# EAGLE design Uzebox Game Console F2 (EAGLE 5.11)
DPN: MCP1700-3302E/TO-ND; PN: 641-1310-1-ND
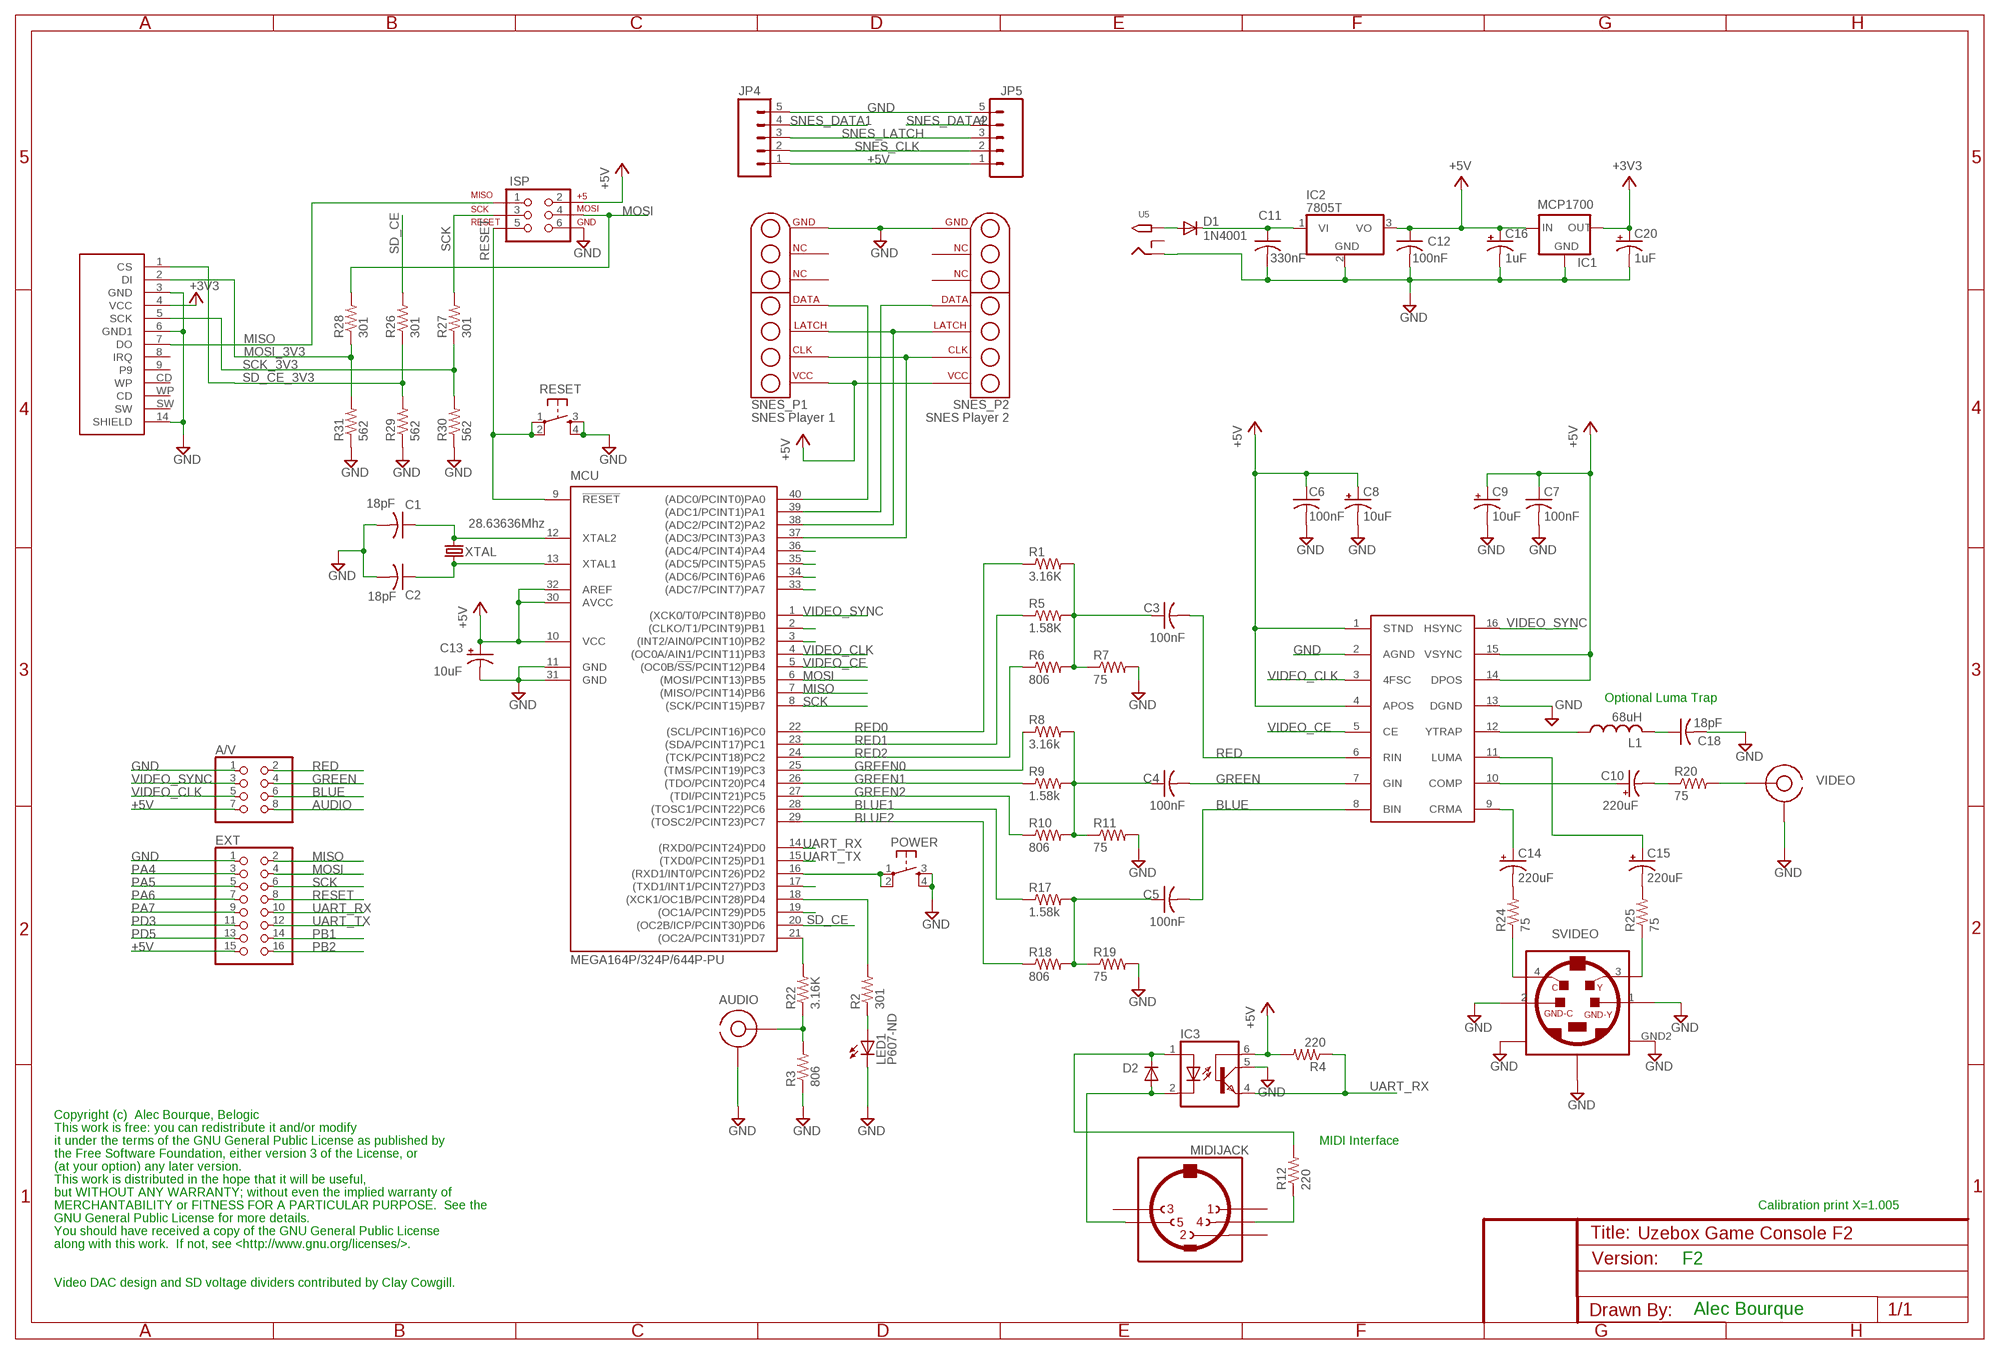
[diagram p0: schematic, sheet 1]

## Parts
A/V  PINHD-2X4  [2X04]
AD725  AD725  [SO16W]
AUDIO  RCA  [RCA]
C1  18pF  C-US025-025X050  [C025-025X050]
C2  18pF  C-US025-025X050  [C025-025X050]
C3  100nF  C-US025-025X050  [C025-025X050]
C4  100nF  C-US025-025X050  [C025-025X050]
C5  100nF  C-US025-025X050  [C025-025X050]
C6  100nF  C-US025-025X050  [C025-025X050]
C7  100nF  C-US025-025X050  [C025-025X050]
C8  10uF  CPOL-USE2.5-6  [E2,5-6]
C9  10uF  CPOL-USE2.5-6  [E2,5-6]
C10  220uF  CPOL-USE2.5-6  [E2,5-6]
C11  330nF  C-US025-025X050  [C025-025X050]
C12  100nF  C-US025-025X050  [C025-025X050]
C13  10uF  CPOL-USE2.5-6  [E2,5-6]
C14  220uF  CPOL-USE2.5-6  [E2,5-6]
C15  220uF  CPOL-USE2.5-6  [E2,5-6]
C16  1uF  CPOL-USE2.5-6  [E2,5-6]
C18  18pF  C-US025-025X050  [C025-025X050]
C20  1uF  CPOL-USE2.5-6  [E2,5-6]
D1  1N4001  1N4004  [DO41-10]
D2  1N4148DO35-7  [DO35-7]
EXT  PINHD-2X8  [2X08]
IC1  MCP1700  MCP1700INLINE  [TO92-INLINE]
IC2  7805T  [TO220H]
IC3  PC110  [DIL06]
ISP  AVR_SPI_PRG_6PTH  [2X3]
JP4  M05PTH  [1X05]
JP5  M05PTH  [1X05]
L1  68uH  L-US6000-XXX-RC  [6000-XXXX-RC]
LED1  P607-ND  LED3MM  [LED3MM]
MCU  MEGA164P/324P/644P-PU  [DIL40]
POWER  USER  TAC_SWITCHPTH  [TACTILE-PTH]
R1  3.16K  R-US_0207/10  [0207/10]
R2  301  R-US_0207/10  [0207/10]
R3  806  R-US_0207/10  [0207/10]
R4  220  R-US_0207/10  [0207/10]
R5  1.58K  R-US_0207/10  [0207/10]
R6  806  R-US_0207/10  [0207/10]
R7  75  R-US_0207/10  [0207/10]
R8  3.16k  R-US_0207/10  [0207/10]
R9  1.58k  R-US_0207/10  [0207/10]
R10  806  R-US_0207/10  [0207/10]
R11  75  R-US_0207/10  [0207/10]
R12  220  R-US_0207/10  [0207/10]
R17  1.58k  R-US_0207/10  [0207/10]
R18  806  R-US_0207/10  [0207/10]
R19  75  R-US_0207/10  [0207/10]
R20  75  R-US_0207/10  [0207/10]
R22  3.16K  R-US_0207/10  [0207/10]
R24  75  R-US_0207/10  [0207/10]
R25  75  R-US_0207/10  [0207/10]
R26  301  R-US_0207/10  [0207/10]
R27  301  R-US_0207/10  [0207/10]
R28  301  R-US_0207/10  [0207/10]
R29  562  R-US_0207/10  [0207/10]
R30  562  R-US_0207/10  [0207/10]
R31  562  R-US_0207/10  [0207/10]
RESET  RESET  TAC_SWITCHPTH  [TACTILE-PTH]
SD/MMC  SD_CARD_SOCKETSD  [SD-MMC_SOCKET-PP]
SNES_P1  SNES Player 1  SNES_CONNECTOR  [SNES_CONNECTOR]
SNES_P2  SNES Player 2  SNES_CONNECTOR  [SNES_CONNECTOR]
SVIDEO  S-VIDEO OUT  MINIDIN  [MINIDIN4]
U5  DC IN  2.1MMJACKTHM  [PJ-102A]
U$5  MIDIJACK  [CP-2350]
VIDEO  RCA  [RCA]
XTAL  28.63636Mhz  CRYSTALHC49S  [HC49/S]

## Nets
+3V3: C20.+ IC1.3(OUT) SD/MMC.4(VCC)
+5V: A/V.7 AD725.1(STND) AD725.4(APOS) AD725.14(DPOS) AD725.15(VSYNC) C6.1 C7.1 C8.+ C9.+ C12.1 C13.+ C16.+ EXT.15 IC1.2(IN) IC2.3(VO) IC3.6(BAS) ISP.2 JP4.1 JP5.1 MCU.10(VCC) MCU.30(AVCC) MCU.32(AREF) R4.2 SNES_P1.P$8(VCC) SNES_P2.P$8(VCC)
AUDIO: A/V.8 AUDIO.SIG R3.2 R22.1
BLUE: A/V.6 AD725.8(BIN) C5.2
BLUE1: MCU.28((TOSC1/PCINT22)PC6) R17.1
BLUE2: MCU.29((TOSC2/PCINT23)PC7) R18.1
GND: A/V.1 AD725.2(AGND) AD725.13(DGND) AUDIO.GND C1.2 C2.2 C6.2 C7.2 C8.- C9.- C11.2 C12.2 C13.- C16.- C18.2 C20.- EXT.1 IC1.1(GND) IC2.2(GND) IC3.5(COL) ISP.6 JP4.5 JP5.5 LED1.K(C) MCU.11(GND) MCU.31(GND) POWER.3 POWER.4 R3.1 R7.2 R11.2 R19.2 R29.1 R30.1 R31.1 RESET.3 RESET.4 SD/MMC.3(GND) SD/MMC.6(GND1) SD/MMC.14(SHIELD) SNES_P1.P$14(GND) SNES_P2.P$14(GND) SVIDEO.1(GND-Y) SVIDEO.2(GND-C) SVIDEO.GND1 SVIDEO.GND2 SVIDEO.GND3 U5.RING VIDEO.GND
GREEN: A/V.4 AD725.7(GIN) C4.2
GREEN0: MCU.25((TMS/PCINT19)PC3) R8.1
GREEN1: MCU.26((TDO/PCINT20)PC4) R9.1
GREEN2: MCU.27((TDI/PCINT21)PC5) R10.1
MISO: EXT.2 ISP.1 MCU.7((MISO/PCINT14)PB6) SD/MMC.7(DO)
MOSI: EXT.4 ISP.4 MCU.6((MOSI/PCINT13)PB5) R28.2
MOSI_3V3: R28.1 R31.2 SD/MMC.2(DI)
N$1: AD725.12(YTRAP) L1.1
N$2: C18.1 L1.2
N$3: C5.1 R17.2 R18.2 R19.1
N$4: C4.1 R8.2 R9.2 R10.2 R11.1
N$5: C3.1 R1.2 R5.2 R6.2 R7.1
N$6: C10.- R20.1
N$7: AD725.10(COMP) C10.+
N$8: R20.2 VIDEO.SIG
N$9: C1.1 MCU.12(XTAL2) XTAL.2
N$10: D1.A U5.TIP
N$11: C14.- R24.2
N$12: C2.1 MCU.13(XTAL1) XTAL.1
N$13: MCU.21((OC2A/PCINT31)PD7) R22.2
N$14: D2.A IC3.2(C) U$5.5
N$16: D2.C IC3.1(A) R12.2
N$17: R12.1 U$5.4
N$20: C11.1 D1.C IC2.1(VI)
N$23: MCU.18((XCK1/OC1B/PCINT28)PD4) R2.2
N$25: LED1.A R2.1
N$26: C15.- R25.2
N$28: AD725.11(LUMA) C15.+
N$29: AD725.9(CRMA) C14.+
N$30: R24.1 SVIDEO.4(C)
N$31: R25.1 SVIDEO.3(Y)
PA4: EXT.3 MCU.36((ADC4/PCINT4)PA4)
PA5: EXT.5 MCU.35((ADC5/PCINT5)PA5)
PA6: EXT.7 MCU.34((ADC6/PCINT6)PA6)
PA7: EXT.9 MCU.33((ADC7/PCINT7)PA7)
PB1: EXT.14 MCU.2((CLKO/T1/PCINT9)PB1)
PB2: EXT.16 MCU.3((INT2/AIN0/PCINT10)PB2)
PD3: EXT.11 MCU.17((TXD1/INT1/PCINT27)PD3)
PD5: EXT.13 MCU.19((OC1A/PCINT29)PD5)
POWER_SW: MCU.16((RXD1/INT0/PCINT26)PD2) POWER.1 POWER.2
RED: A/V.2 AD725.6(RIN) C3.2
RED0: MCU.22((SCL/PCINT16)PC0) R1.1
RED1: MCU.23((SDA/PCINT17)PC1) R5.1
RED2: MCU.24((TCK/PCINT18)PC2) R6.1
RESET: EXT.8 ISP.5 MCU.9(!RESET) RESET.1 RESET.2
SCK: EXT.6 ISP.3 MCU.8((SCK/PCINT15)PB7) R27.2
SCK_3V3: R27.1 R30.2 SD/MMC.5(SCK)
SD_CE: MCU.20((OC2B/ICP/PCINT30)PD6) R26.2
SD_CE_3V3: R26.1 R29.2 SD/MMC.1(CS)
SNES_CLK: JP4.2 JP5.2 MCU.37((ADC3/PCINT3)PA3) SNES_P1.P$9(CLK) SNES_P2.P$9(CLK)
SNES_DATA1: JP4.4 MCU.40((ADC0/PCINT0)PA0) SNES_P1.P$11(DATA)
SNES_DATA2: JP5.4 MCU.39((ADC1/PCINT1)PA1) SNES_P2.P$11(DATA)
SNES_LATCH: JP4.3 JP5.3 MCU.38((ADC2/PCINT2)PA2) SNES_P1.P$10(LATCH) SNES_P2.P$10(LATCH)
UART_RX: EXT.10 IC3.4(EMI) MCU.14((RXD0/PCINT24)PD0) R4.1
UART_TX: EXT.12 MCU.15((TXD0/PCINT25)PD1)
VIDEO_CE: AD725.5(CE) MCU.5((OC0B/!SS!/PCINT12)PB4)
VIDEO_CLK: A/V.5 AD725.3(4FSC) MCU.4((OC0A/AIN1/PCINT11)PB3)
VIDEO_SYNC: A/V.3 AD725.16(HSYNC) MCU.1((XCK0/T0/PCINT8)PB0)
Unconnected: SD/MMC.8(IRQ) SD/MMC.9 SD/MMC.CD(WP) SD/MMC.SW SD/MMC.WP(CD) SNES_P1.P$12(NC1) SNES_P1.P$13(NC2) SNES_P2.P$12(NC1) SNES_P2.P$13(NC2) U5.RING_SW U$5.1 U$5.2 U$5.3 U$5.PE1(MT) U$5.PE2(MT) U$5.PE(MT) U$5.PE@(MT)

## Notes on the sheet
- Optional Luma Trap
- Copyright (c)  Alec Bourque, Belogic
- This work is free: you can redistribute it and/or modify
- it under the terms of the GNU General Public License as published by | MIDI Interface
- the Free Software Foundation, either version 3 of the License, or
- (at your option) any later version.
- This work is distributed in the hope that it will be useful,
- but WITHOUT ANY WARRANTY; without even the implied warranty of
- MERCHANTABILITY or FITNESS FOR A PARTICULAR PURPOSE.  See the | Calibration print X=1.005
- GNU General Public License for more details.
- You should have received a copy of the GNU General Public License
- along with this work.  If not, see <http://www.gnu.org/licenses/>.
- F2
- Video DAC design and SD voltage dividers contributed by Clay Cowgill.
- Alec Bourque

## Library data of the parts
A/V = pinhead:PINHD-2X4: PIN HEADER
AD725 = ad725:AD725
AUDIO VIDEO = rca:RCA: RCA jack
C1 C2 C6 C7 C11 C12 C18 = resistor:C-US: CAPACITOR, American symbol
C3-C5 = rcl:C-US: CAPACITOR, American symbol
C8-C10 C13-C16 C20 = rcl:CPOL-US: POLARIZED CAPACITOR, American symbol
D1 = adafruit:1N4004: DIODE General purpose 1N400x type rectifier (With bigger pads) http://www.ladyada.net/library/pcb/eaglelibrary.html
D2 = diode:1N4148: DIODE high speed (Philips)
EXT = pinhead:PINHD-2X8: PIN HEADER
IC1 = adafruit:MCP1700: VOLTAGE REGULATOR
IC2 = adafruit:78*: Positive VOLTAGE REGULATOR Added bigger pads to the TO-92 package
IC3 = optocoupler:PC110: SHARP OPTO COUPLER; OC_FARNELL: unknown; OC_NEWARK: unknown
ISP = SparkFun:AVR_SPI_PRG_6: AVR ISP 6 Pin This is the reduced ISP connector for AVR programming. Common on Arduino. This footprint will take up less PCB space and can be used with a 10-pin to 6-pin adapter such as SKU: BOB-08508
JP4 JP5 = SparkFun:M05: Header 5 Standard 5-pin 0.1" header. Use with straight break away headers (SKU : PRT-00116), right angle break away headers (PRT-00553), swiss pins (PRT-00743), machine pins (PRT-00117), and female headers (PRT-00115). Molex polarized connector foot print use with SKU : PRT-08230 with associated crimp pins and housings.
L1 = rcl:L-US: INDUCTOR, American symbol
LED1 = adafruit:LED: LED OSRAM: - CHIPLED LG R971, LG N971, LY N971, LG Q971, LY Q971, LO R971, LY R971 LH N974, LH R974 LS Q976, LO Q976, LY Q976 LO Q996 - Hyper CHIPLED LW Q18S LB Q993, LB Q99A, LB R99A - SideLED LS A670, LO A670, LY A670, LG A670, LP A670 LB A673, LV A673, LT A673, LW A673 LH A674 LY A675 LS A676, LA A676, LO A676, LY A676, LW A676 LS A679, LY A679, LG A679 - Hyper Micro SIDELED® LS Y876, LA Y876, LO Y876, LY Y876 LT Y87S - SmartLED LW L88C, LW L88S LB L89C, LB L89S, LG L890 LS L89K, LO L89K, LY L89K LS L896, LA L896, LO L896, LY L896 - TOPLED LS T670, LO T670, LY T670, LG T670, LP T670 LSG T670, LSP T670, LSY T670, LOP T670, LYG T670 LG T671, LOG T671, LSG T671 LB T673, LV T673, LT T673, LW T673 LH T674 LS T676, LA T676, LO T676, LY T676, LB T676, LH T676, LSB T676, LW T676 LB T67C, LV T67C, LT T67C, LS T67K, LO T67K, LY T67K, LW E67C LS E67B, LA E67B, LO E67B, LY E67B, LB E67C, LV E67C, LT E67C LW T67C LS T679, LY T679, LG T679 LS T770, LO T770, LY T770, LG T770, LP T770 LB T773, LV T773, LT T773, LW T773 LH T774 LS E675, LA E675, LY E675, LS T675 LS T776, LA T776, LO T776, LY T776, LB T776 LHGB T686 LT T68C, LB T68C - Hyper Mini TOPLED® LB M676 - Mini TOPLED Santana® LG M470 LS M47K, LO M47K, LY M47K Source: http://www.osram.convergy.de/
MCU = avr-5:MEGA164P/324P/644P-PU
POWER RESET = SparkFun:TAC_SWITCH: Momentary Switch Button commonly used for reset or general input. Spark Fun Electronics SKU : COM-00097
R1-R12 R17-R20 R22 R24-R31 = resistor:R-US_: RESISTOR, American symbol
SD/MMC = SparkFun:SD_CARD_SOCKET: SD/MMC Socket Media socket for SD and MMC cards. Push-push type. Schematic element and footprint production proven. Spark Fun Electronics SKU : PRT-00136
SNES_P1 SNES_P2 = snes:SNES_CONNECTOR: Generic SNES connector
SVIDEO = mini-din4:MINIDIN: mini-din 4 connector
U5 = adafruit:2.1MMJACK: 2.1mm x 5.5mm THM DC jack with internal switch. Digikey part #PJ-102A, 4UCON part #05537 2.1mm x 5.5mm SMT DC jack with internal switch. Digikey part #PJ-002A-SMT, 4UCON part #03267 By microbuilder.eu & adafruit.com
U$5 = adafruit:MIDIJACK: DIN 5 jack also known as MIDI jack A modification of conn-hirshman:MAB5SH with two options for the grounding 'teeth'
XTAL = crystal:CRYSTAL: CRYSTAL; OC_FARNELL: 1667008; OC_NEWARK: unknown

## Board
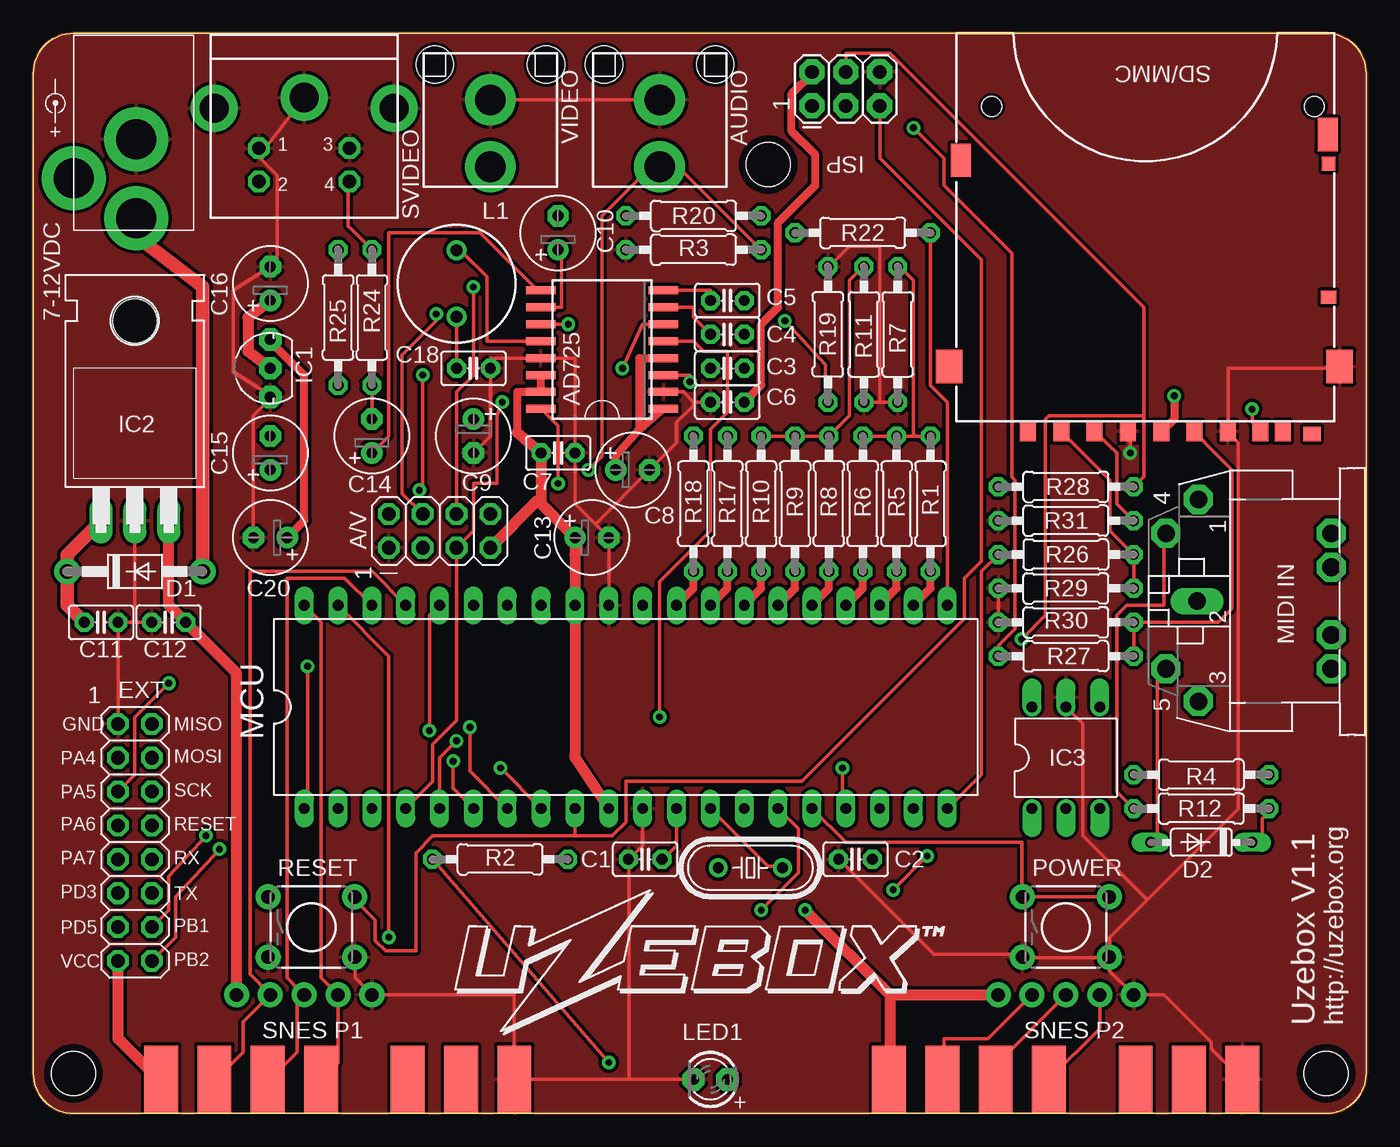
[diagram p1: board, top side]
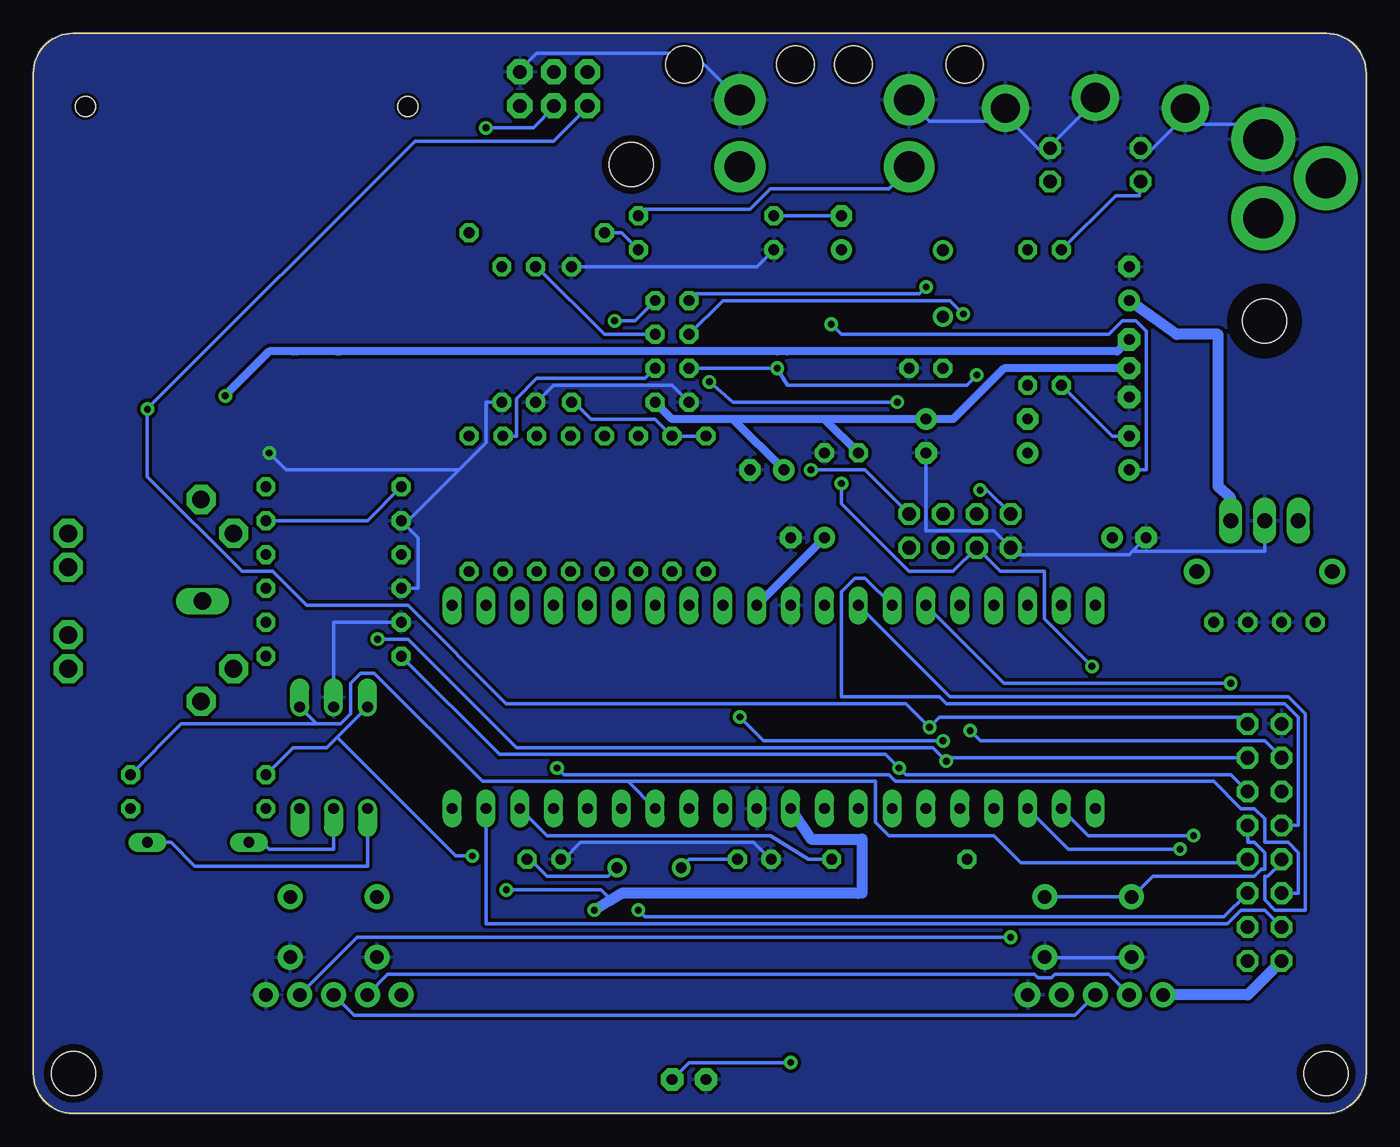
[diagram p2: board, bottom side, seen from below]

Size 100 x 81 mm. Coordinates in mm from the lower left corner, seen from the top.
Outline: 3,0 arc-90 0,3 0,78 arc-90 3,81 97,81 arc-90 100,78 100,3 arc-90 97,0 3,0
Copper layers (1*16): Top 0.035mm / dielectric 1.5mm / Bottom 0.035mm
Design rules "Uze based on SparkFun for ITead": minimum track width 10mil, minimum drill 20mil, track to track 10mil, track to pad 10mil, pad to pad 10mil, via to via 10mil, smd to smd 8mil, copper to edge 0mil, drill to drill 10mil, minimum pad ring 12mil, minimum via ring 10mil, stop-mask expansion 4mil, vias tented up to drill 100mil, thermal gap 10mil

### Footprints (pad centres in the part's own frame; a part is rotated, then mirrored left to right if it is on the bottom)
2X04 = drill 1.016 octagon: 1 -3.81,-1.27; 2 -3.81,1.27; 3 -1.27,-1.27; 4 -1.27,1.27; 5 1.27,-1.27; 6 1.27,1.27; 7 3.81,-1.27; 8 3.81,1.27
SO16W = smd 0.6 x 2.2: 1 -4.445,-4.6; 2 -3.175,-4.6; 3 -1.905,-4.6; 4 -0.635,-4.6; 5 0.635,-4.6; 6 1.905,-4.6; 7 3.175,-4.6; 8 4.445,-4.6; 9 4.445,4.6; 10 3.175,4.6; 11 1.905,4.6; 12 0.635,4.6; 13 -0.635,4.6; 14 -1.905,4.6; 15 -3.175,4.6; 16 -4.445,4.6
RCA = drill 2.3 pad 3.81 round: GND 0,0.508; SIG 0,-4.5 | hole 2.8: -4.175,3.15; 4.175,3.15
C025-025X050 = drill 0.813 octagon: 1 -1.27,0; 2 1.27,0
E2,5-6 = drill 0.813 pad 1.6 round: + -1.27,0 | drill 0.813 pad 1.6 octagon: - 1.27,0
DO41-10 = drill 1.118 pad 1.93 round: A 5.08,0; C -5.08,0
DO35-7 = drill 0.813 long: A 3.81,0; C -3.81,0
2X08 = drill 1.016 octagon: 1 -8.89,-1.27; 2 -8.89,1.27; 3 -6.35,-1.27; 4 -6.35,1.27; 5 -3.81,-1.27; 6 -3.81,1.27; 7 -1.27,-1.27; 8 -1.27,1.27; 9 1.27,-1.27; 10 1.27,1.27; 11 3.81,-1.27; 12 3.81,1.27; 13 6.35,-1.27; 14 6.35,1.27; 15 8.89,-1.27; 16 8.89,1.27
TO92-INLINE = drill 0.813 pad 1.676 octagon: 1 -2.159,0; 2 0,0; 3 2.159,0
TO220H = drill 1.118 long: 1 -2.54,-10.16; 2 0,-10.16; 3 2.54,-10.16 | hole 3.302: 0,4.826
DIL06 = drill 0.813 offset: 1 -2.54,-3.81; 2 0,-3.81; 3 2.54,-3.81; 4 2.54,3.81; 5 0,3.81; 6 -2.54,3.81
2X3 = drill 1.016 pad 1.88 octagon: 1 0,0; 2 0,2.54; 3 2.54,0; 4 2.54,2.54; 5 5.08,0; 6 5.08,2.54
1X05 = drill 1.016 pad 1.88 round: 1 0,0; 2 2.54,0; 3 5.08,0; 4 7.62,0; 5 10.16,0
6000-XXXX-RC = drill 0.9 pad 1.422 round: 1 -2.5,0; 2 2.5,0
LED3MM = drill 0.813 pad 1.676 octagon: A -1.27,0; K 1.27,0
DIL40 = drill 0.813 long: 1 -24.13,-7.62; 2 -21.59,-7.62; 3 -19.05,-7.62; 4 -16.51,-7.62; 5 -13.97,-7.62; 6 -11.43,-7.62; 7 -8.89,-7.62; 8 -6.35,-7.62; 9 -3.81,-7.62; 10 -1.27,-7.62; 11 1.27,-7.62; 12 3.81,-7.62; 13 6.35,-7.62; 14 8.89,-7.62; 15 11.43,-7.62; 16 13.97,-7.62; 17 16.51,-7.62; 18 19.05,-7.62; 19 21.59,-7.62; 20 24.13,-7.62; 21 24.13,7.62; 22 21.59,7.62; 23 19.05,7.62; 24 16.51,7.62; 25 13.97,7.62; 26 11.43,7.62; 27 8.89,7.62; 28 6.35,7.62; 29 3.81,7.62; 30 1.27,7.62; 31 -1.27,7.62; 32 -3.81,7.62; 33 -6.35,7.62; 34 -8.89,7.62; 35 -11.43,7.62; 36 -13.97,7.62; 37 -16.51,7.62; 38 -19.05,7.62; 39 -21.59,7.62; 40 -24.13,7.62
TACTILE-PTH = drill 1.016 pad 1.88 round: 1 -3.251,2.261; 2 3.251,2.261; 3 -3.251,-2.261; 4 3.251,-2.261
0207/10 = drill 0.813 octagon: 1 -5.08,0; 2 5.08,0
SD-MMC_SOCKET-PP = smd 1.2 x 1.5: 1 6.88,29.85; 2 4.38,29.85; 3 1.88,29.85; 4 -0.62,29.85; 5 -3.12,29.85; 6 -5.62,29.85; 7 -8.04,29.85; 8 -9.728,29.87; 9 9.38,29.85 | smd 1.5 x 2.5: 12 -13.1,7.6; 13 14.402,9.525 | smd 2 x 2.5: 14 -14,25; 15 15.3,25 | smd 1.15 x 1: CD -13.18,19.8 | smd 1.3 x 1.1: SW -11.938,30.048 | smd 1 x 1.05: WP -13.18,9.8 | hole 1.5: -12.1,5.5; 12.1,5.5
SNES_CONNECTOR = smd 2.54 x 5.08: P$8 -12,2.54; P$9 -8,2.54; P$10 -4,2.54; P$11 0,2.54; P$12 6.5,2.54; P$13 10.5,2.54; P$14 14.5,2.54
MINIDIN4@1 = drill 1 octagon: 1 -3.4,-3.8; 2 3.4,-3.8; 3 -3.4,-6.3; 4 3.4,-6.3 | drill 2.2 pad 3.5 round: GND1 -6.75,-0.8; GND2 0,0; GND3 6.75,-0.8
PJ-102A = drill 3 pad 4.8 round: RING 0.1,-3.39; RING_SW -4.6,-6.29; TIP 0.1,-9.29
STAND-OFF = hole 3.302: 0,0
CP-2350 = drill 1.321 pad 2.184 octagon: 1 7.62,12.58; 3 -7.52,12.58; 4 5.08,15.02; 5 -5.08,15.02; PE -2.54,2.62; PE1 -5.08,2.62; PE2 5.08,2.62; PE@ 2.54,2.62 | drill 1.321 long: 2 0,12.68
HC49/S = drill 0.813 round: 1 -2.413,0; 2 2.413,0

### Placement (x,y rotation side)
A/V  30.48,43.69 0 top
AD725  42.67,57.28 90 top
AUDIO  46.99,75.5 0 top
C1  45.91,19.05 180 top
C2  61.69,19.05 180 top
C3  52.07,55.88 180 top
C4  52.07,58.42 180 top
C5  52.07,60.96 180 top
C6  52.07,53.34 180 top
C7  39.37,49.53 0 top
C8  44.96,48.26 0 top
C9  33.02,50.8 270 top
C10  39.37,66.04 90 top
C11  5.08,36.83 0 top
C12  10.16,36.83 180 top
C13  41.91,43.18 0 top
C14  25.4,50.8 90 top
C15  17.78,49.53 90 top
C16  17.78,62.23 90 top
C18  33.02,55.88 0 top
C20  17.78,43.18 180 top
D1  7.62,40.64 0 top
D2  87.63,20.32 180 top
EXT  7.62,20.32 270 top
IC1  17.78,55.88 90 top
IC2  7.62,54.61 0 top
IC3  77.47,26.67 0 top
ISP  58.42,75.56 0 top
JP4  15.24,8.89 0 top
JP5  72.39,8.89 0 top
L1  31.75,62.23 270 top
LED1  50.8,2.54 180 top
MCU  44.45,30.48 0 top
POWER  77.47,13.97 0 top
R1  67.31,45.72 90 top
R2  35.02,19.05 0 top
R3  49.53,64.77 0 top
R4  87.63,25.4 180 top
R5  64.77,45.72 90 top
R6  62.23,45.72 90 top
R7  64.85,58.42 270 top
R8  59.69,45.72 90 top
R9  57.15,45.72 90 top
R10  54.61,45.72 90 top
R11  62.31,58.42 270 top
R12  87.63,22.86 0 top
R17  52.07,45.72 90 top
R18  49.53,45.72 90 top
R19  59.61,58.42 90 top
R20  49.53,67.31 0 top
R22  62.23,66.04 0 top
R24  25.4,59.69 270 top
R25  22.86,59.69 270 top
R26  77.47,41.91 180 top
R27  77.47,34.29 180 top
R28  77.47,46.99 0 top
R29  77.47,39.37 0 top
R30  77.47,36.83 0 top
R31  77.47,44.45 0 top
RESET  20.86,13.97 0 top
SD/MMC  84,81.01 180 top
SNES_P1  21.59,0 0 top
SNES_P2  76.2,0 0 top
SVIDEO  S-VIDEO OUT  [MINIDIN4@1]  20.32,76.18 0 top
U5  7.62,76.44 0 top
U$2  [STAND-OFF]  3,3 0 top
U$3  [STAND-OFF]  97,3 180 top
U$4  [STAND-OFF]  55.14,71.15 0 top
U$5  100,38.42 90 top
U$6  [LOGO]  40.91,12 0 top
U$7  [POWER]  1.65,76.71 270 top
U$8  [BUMPON]  5.79,59.85 0 top
U$9  [BUMPON]  6.05,5.92 0 top
U$10  [BUMPON]  93.95,5.79 0 top
U$11  [BUMPON]  93.83,73.83 0 top
VIDEO  34.29,75.5 0 top
XTAL  53.8,18.41 180 top

### Tracks (layer width: path | path; a pad name or v marks a point on that pad's centre or on a via)
+3V3  (via drill 0.51)
  Top 0.254: 17.78,57.91 IC1.3 | 84.84,51.31 SD/MMC.4 84.84,51.31 | v85.6,53.82 85.6,53.59 v85.6,53.82
  Top 0.61: C20.+ 20.32,44.45 20.32,55.37 17.78,57.91 | 84.84,51.31 85.6,52.07 85.6,53.59
  Bottom 0.254: 85.6,53.85 v85.6,53.82 85.6,53.85
  Bottom 0.61: IC1.3 18.67,57.15 43.43,57.15 44.2,57.15 76.99,57.15 77.22,57.15 80.26,57.15 80.52,57.15 82.3,57.15 85.6,53.85
+5V  (via drill 0.51)
  Top 0.254: 64.26,2.54 SNES_P2.P$8 | SNES_P1.P$8 9.4,2.54 | AD725.15 38.1,54.1 | 38.1,55.37 AD725.14 | 47.24,52.83 AD725.1 | 58.42,77.98 ISP.2 | 40.64,26.92 40.64,26.67 | 38.1,45.97 37.85,45.97 | v64.52,16.76 v67.06,19.3
  Top 0.61: 38.1,54.1 38.1,55.37 | 36.32,51.05 36.32,54.1 AD725.15 | 45.47,51.31 43.69,49.28 C8.+ | 45.47,51.31 47.24,52.83 | 45.47,51.31 45.47,56.64 AD725.4 | 58.42,77.98 56.9,76.45 56.9,73.66 58.67,71.88 58.67,69.6 55.88,66.8 55.88,60.45 54.61,59.18 54.61,54.61 C6.1
  Top 0.813: 64.26,8.89 JP5.1 | 64.26,8.89 64.26,2.54 | 40.64,26.67 MCU.10 | v57.91,15.24 64.26,8.89 | 9.4,2.54 6.35,5.59 EXT.15 | IC2.3 10.16,38.1 C12.1 15.24,33.02 JP4.1 | C16.+ 16.1,59.69 16.1,57.15 IC1.2 | 36.32,51.05 C7.1 38.1,45.97 38.1,45.72 C13.+ 40.64,41.91 MCU.32 40.64,26.92 | 37.85,45.97 A/V.7
  Bottom 0.254: 77.22,28.19 77.98,27.43 80.52,27.43 R4.2 | 77.22,28.19 IC3.6 | 77.22,28.19 68.33,19.3 v67.06,19.3 | v64.52,16.76 57.4,16.76 56.9,16.26 56.72,15.98
  Bottom 0.61: C6.1 52.07,52.07 47.5,52.07 | 47.5,52.07 C8.+ | 40.64,52.07 47.5,52.07 | 40.64,52.07 C9.+ 30.99,52.07 27.18,55.88 IC1.2 | 40.64,52.07 C7.1 | C13.+ MCU.30
  Bottom 0.813: v57.91,15.24 56.72,15.98 55.88,16.5 38.1,16.5 37.83,16.54 37.83,20.57 41.64,20.57 MCU.10 | EXT.15 8.89,8.89 JP4.1 | IC2.3 10.16,46.16 11.1,47 11.1,58.42 14.24,58.42 C16.+
AUDIO  (via drill 0.51)
  Top 0.254: v41.66,48.26 42.67,49.28 42.67,67.31 46.99,71.63 AUDIO.SIG 46.99,71.37 48.01,71.37 R3.2
  Bottom 0.254: R3.2 55.88,66.04 R22.1 | v41.66,48.26 38.1,48.26 37.59,48.26 A/V.8
BLUE  (via drill 0.51)
  Top 0.254: C5.2 50.8,61.72 47.5,61.72 AD725.8 | A/V.6 31.75,54.1 33.02,55.37 v33.02,61.98
  Bottom 0.254: v33.02,61.98 33.53,61.47 50.29,61.47 C5.2
BLUE1
  Top 0.61: MCU.28 52.07,39.37 R17.1
BLUE2
  Top 0.61: MCU.29 49.53,39.37 R18.1
GND  (via drill 0.51)
  Top 0.254: C9.- 34.29,50.8 C18.2 34.29,56.64 37.85,56.64 AD725.13 38.1,56.64 40.64,56.64 C7.2 40.64,45.72 42.16,44.2 | MCU.31 C13.- 42.16,44.2 | 42.16,44.2 C8.- 48.26,50.29 48.26,51.82 49.53,53.09 49.53,53.34 | R30.1 R29.1 | 63.5,53.34 64.77,53.34 R7.2 | 63.5,53.34 62.48,53.34 R11.2 | 49.53,53.34 48.77,54.1 47.5,54.1 AD725.2 | C6.2 49.53,53.34 | 63.5,53.34 63.5,65.02 61.21,65.02 59.69,63.5 R19.2 | 7.62,36.83 C12.2 | 7.62,36.83 C11.2 EXT.1 | IC2.2 7.62,36.83 | C20.- 16.51,52.32 17.78,53.59 IC1.1 17.78,53.85 15,55.63 15,61.72 C16.- | C16.- 18.29,64.01 | 17.02,71.63 17.02,71.88 SVIDEO.GND2 20.32,74.93 | 17.02,71.63 SVIDEO.1 17.02,71.63 | VIDEO.GND AUDIO.GND | 44.7,19.05 45.72,20.07 MCU.11 | 44.7,19.05 C1.2 44.7,19.05 | RESET.4 24.13,11.68 24.13,10.16 JP4.5 36.07,8.89 36.07,2.54 SNES_P1.P$14 36.32,2.54 44.7,2.54 | 44.7,2.54 LED1.K | 44.7,2.54 44.7,19.05 | POWER.4 80.52,11.68 74.42,11.68 POWER.3 74.17,11.94 67.56,11.94 60.45,19.05 C2.2 | POWER.4 80.77,11.68 80.77,10.67 JP5.5 84.84,8.89 88.39,5.33 88.39,4.83 90.68,2.54 SNES_P2.P$14 | 83.57,16 80.77,13.21 80.77,11.94 POWER.4 | 83.57,16 90.42,22.86 90.42,50.04 90.42,50.29 89.66,51.05 SD/MMC.6 89.66,51.31 89.66,55.88 97.79,55.88 SD/MMC.14 | IC3.5 78.74,29.21 78.74,20.83 83.57,16 | 17.02,71.63 18.29,70.36 18.29,64.01 | C16.- 18.29,64.01 | v82.3,49.53 82.3,51.05 SD/MMC.3
  Bottom 0.254: IC3.5 77.47,36.83 R30.1 | 72.14,44.2 71.12,43.18 71.12,39.37 R29.1 | 72.14,44.2 R31.1 72.14,44.2 | R3.1 45.72,63.5 59.44,63.5 R19.2 | C6.2 52.07,54.61 60.96,54.61 62.23,53.34 R11.2 | 72.14,44.2 68.07,48.26 | 68.07,48.26 66.04,50.29 66.04,53.34 65.02,53.34 R7.2 | 17.53,42.16 17.78,41.91 26.16,41.91 A/V.1 27.94,43.69 33.02,43.69 C9.- | 17.53,42.16 C20.- | IC2.2 7.62,42.16 17.53,42.16 | AUDIO.GND 50.55,79.5 62.23,79.5 63.5,78.23 ISP.6 | SVIDEO.1 16.76,71.63 14.22,74.17 13.72,74.17 SVIDEO.GND1 13.46,74.17 9.4,74.17 7.37,72.14 U5.RING | VIDEO.GND 32.77,74.42 27.18,74.42 SVIDEO.GND3 26.92,74.17 26.42,74.17 23.88,71.63 SVIDEO.2 23.88,72.39 20.32,75.95 SVIDEO.GND2 | C2.2 60.2,19.05 58.93,20.32 45.97,20.32 44.7,19.05 C1.2 | RESET.3 17.78,11.68 23.88,11.68 RESET.4 | v82.3,49.53 81.03,48.26 68.07,48.26
  pour Top (isolate 0.254): 0,78 arc-90 3,81 97,81 arc-90 100,78 100,3 arc-90 97,0 3,0 arc-90 0,3
  pour Bottom (isolate 0.254): 0,78 arc-90 3,81 97,81 arc-90 100,78 100,3 arc-90 97,0 3,0 arc-90 0,3
GREEN  (via drill 0.51)
  Top 0.254: C4.2 49.53,59.69 49.53,60.45 47.5,60.45 AD725.7 | A/V.4 27.69,46.48 27.69,56.9 30.23,59.44 v30.23,59.94
  Bottom 0.254: v30.23,59.94 31.24,60.96 48.26,60.96 C4.2
GREEN0
  Top 0.61: MCU.25 59.69,39.37 R8.1
GREEN1
  Top 0.61: MCU.26 57.15,39.37 R9.1
GREEN2
  Top 0.61: MCU.27 54.61,39.37 R10.1
MISO  (via drill 0.51)
  Top 0.254: MCU.7 32.77,25.65 v32.77,28.96 | 91.44,52.83 v91.44,52.82 91.44,52.58 91.44,51.82 91.95,51.31 SD/MMC.7
  Bottom 0.254: EXT.2 9.4,29.72 32,29.72 v32.77,28.96 34.54,30.73 64.52,30.73 71.88,38.1 79.5,38.1 82.04,40.64 84.33,40.64 91.44,47.75 91.44,52.58 v91.44,52.82 91.44,52.83 71.37,72.9 70.36,72.9 60.96,72.9 58.42,75.44 ISP.1
MOSI  (via drill 0.51)
  Top 0.254: MCU.6 31.5,24.38 v31.5,26.42 | R28.2 83.31,47.75 83.31,52.32 | 83.31,52.32 83.31,60.45 64.26,79.5 60.96,79.5 60.96,78.23 ISP.4 | v74.17,35.56 75.95,37.34 75.95,52.07 76.2,52.32 83.31,52.32
  Bottom 0.254: EXT.4 31.24,26.67 v31.5,26.42 32.51,27.43 63.75,27.43 71.88,35.56 v74.17,35.56
MOSI_3V3
  Top 0.254: R31.2 81.28,45.72 81.28,49.53 80.77,50.04 SD/MMC.2
  Bottom 0.254: R28.1 74.93,44.45 R31.2
N$1
  Top 0.254: AD725.12 37.85,57.91 34.04,57.91 34.04,62.74 32.26,64.52 31.75,64.52 L1.1
N$2
  Top 0.254: C18.1 31.75,59.69 L1.2
N$3  (via drill 0.51)
  Top 0.254: v56.39,59.44 59.44,56.13 59.44,53.34 R19.1
  Bottom 0.254: R18.2 R17.2 53.34,52.07 58.17,52.07 59.44,53.34 R19.1 | C5.1 54.86,59.44 v56.39,59.44
N$4
  Top 0.254: R10.2 R9.2 R8.2 61.21,52.32 61.21,62.48 62.23,63.5 R11.1
  Bottom 0.254: C4.1 57.15,58.42 62.23,63.5 R11.1
N$5
  Top 0.254: R6.2 R5.2 66.04,50.8 | 66.04,50.8 R1.2 | 66.04,50.8 66.04,62.48 65.02,63.5 R7.1
  Bottom 0.254: C3.1 54.1,55.12 62.23,55.12 63.75,53.59 63.75,50.8 R5.2
N$6
  Bottom 0.254: C10.- R20.1
N$7
  Top 0.254: C10.+ 39.62,64.52 39.62,60.45 38.1,60.45 AD725.10
N$8
  Bottom 0.254: R20.2 54.1,67.82 46.23,67.82 44.7,69.34 36.32,69.34 35.81,69.34 34.29,70.87 VIDEO.SIG
N$9
  Top 0.254: MCU.12 48.26,20.07 47.24,19.05 C1.1
  Bottom 0.254: XTAL.2 51.31,18.54 50.8,19.05 47.24,19.05 C1.1
N$10
  Top 0.254: 7.37,66.04 U5.TIP
  Top 1.016: D1.A 12.7,41.91 12.7,61.98 7.37,66.04
N$11
  Top 0.254: C14.- R24.2
N$12
  Top 0.254: MCU.13 55.12,18.54 56.13,18.54 XTAL.1
  Bottom 0.254: C2.1 62.74,19.05 61.47,17.78 56.9,17.78 56.39,18.29 XTAL.1
N$13
  Top 0.254: MCU.21 68.58,53.34 67.31,54.61 R22.2
N$14
  Top 0.254: D2.A 84.33,20.83 84.33,32.77 84.84,33.27 U$5.5
  Bottom 0.254: IC3.2 77.47,19.81 82.3,19.81 82.8,20.32 D2.A
N$16
  Top 0.254: D2.C 92.2,21.08 92.2,22.1 92.71,22.61 R12.2
  Bottom 0.254: IC3.1 74.93,18.54 87.88,18.54 89.66,20.32 D2.C
N$17
  Top 0.254: U$5.4 84.84,43.43 84.84,38.1 82.04,38.1 81.28,37.34 81.28,25.4 81.28,24.13 R12.1
N$20
  Top 1.016: C11.1 2.54,38.1 D1.C 2.54,41.91 IC2.1
N$23
  Bottom 0.254: R2.2 41.86,19.05 44.69,20.81 44.7,20.83 61.47,20.83 MCU.18
N$25  (via drill 0.51)
  Top 0.254: R2.1 v43.18,3.81
  Bottom 0.254: v43.18,3.81 50.8,3.81 LED1.A
N$26
  Bottom 0.254: R25.2 19.05,50.8 C15.-
N$28  (via drill 0.51)
  Top 0.254: v40.13,59.18 38.1,59.18 AD725.11
  Bottom 0.254: v40.13,59.18 39.37,58.42 19.3,58.42 18.29,59.44 17.27,59.44 16.51,58.67 16.51,48.26 C15.+
N$29
  Top 0.254: C14.+ 26.67,50.8 26.67,66.04 33.53,66.04 37.85,61.72 AD725.9
N$30
  Top 0.254: R24.1 23.88,66.29 23.62,66.55 23.62,69.85 SVIDEO.4
N$31
  Bottom 0.254: R25.1 18.8,68.83 17.02,68.83 SVIDEO.3
PA4  (via drill 0.51)
  Top 0.254: MCU.36 29.72,37.34 v29.72,28.7
  Bottom 0.254: v29.72,28.7 28.96,27.94 7.62,27.94 EXT.3
PA5  (via drill 0.51)
  Top 0.254: v10.16,32.26 7.62,29.72 7.62,25.4 EXT.5
  Bottom 0.254: MCU.35 27.18,32.26 v10.16,32.26
PA6
  Bottom 0.254: MCU.34 37.59,40.13 38.35,40.13 39.37,39.12 39.37,31.24 32,31.24 31.5,30.73 6.1,30.73 5.08,29.72 5.08,21.59 EXT.7
PA7
  Bottom 0.254: MCU.33 31.24,31.24 5.84,31.24 4.57,29.97 4.57,15.24 6.86,15.24 7.62,16 7.62,17.78 7.37,17.78 6.35,18.8 EXT.9
PB1  (via drill 0.51)
  Top 0.254: v12.95,20.83 10.16,17.78 10.16,15.24 EXT.14
  Bottom 0.254: MCU.2 20.83,20.83 v12.95,20.83
PB2  (via drill 0.51)
  Top 0.254: v13.97,19.81 10.67,16.26 10.67,13.21 EXT.16
  Bottom 0.254: MCU.3 22.35,19.81 v13.97,19.81
PD3  (via drill 0.51)
  Top 0.254: MCU.17 60.71,23.11 v60.71,25.91
  Bottom 0.254: v60.71,25.91 60.2,25.4 35.81,25.4 35.31,24.89 11.43,24.89 9.4,22.86 8.38,22.86 7.62,22.1 7.62,20.32 5.84,20.32 5.08,19.56 5.08,16.51 EXT.11
PD5
  Bottom 0.254: MCU.19 66.04,14.22 10.41,14.22 9.4,15.24 7.62,15.24 EXT.13
POWER_SW
  Top 0.254: MCU.16 60.96,20.32 74.17,20.32 74.17,16.26 POWER.1 74.42,16.26 80.52,16.26 POWER.2
RED  (via drill 0.51)
  Top 0.254: v44.2,55.88 45.72,59.18 47.24,59.18 AD725.6 | v29.21,55.37 29.21,46.99 v28.96,46.74
  Bottom 0.254: C3.2 44.96,55.88 v44.2,55.88 43.43,54.61 29.97,54.61 v29.21,55.37 | A/V.2 28.45,46.74 v28.96,46.74
RED0
  Top 0.61: MCU.22 67.31,39.37 R1.1
RED1
  Top 0.61: MCU.23 64.77,39.37 R5.1
RED2
  Top 0.61: MCU.24 62.23,39.37 R6.1
RESET
  Top 0.254: 40.64,20.83 43.43,20.83 44.45,21.84 44.45,24.89 57.66,24.89 69.85,37.08 69.85,40.13 71.12,41.4 71.12,64.01 63.5,71.63 63.5,75.44 ISP.5 | 40.64,20.83 MCU.9 | 40.64,20.83 29.97,20.83 28.7,19.56 28.7,12.19 26.42,12.19 25.65,12.95 25.65,14.48 24.13,16 RESET.2
  Bottom 0.254: EXT.8 8.89,20.32 8.38,20.32 7.62,19.56 7.62,18.29 7.87,18.29 8.38,17.78 16,17.78 17.53,16.26 RESET.1 17.78,16.26 23.88,16.26 RESET.2 24.13,16.26
SCK  (via drill 0.51)
  Top 0.254: v35.05,25.91 MCU.8 | R27.2 72.39,35.05 73.66,36.32 73.66,47.5 73.41,47.75 73.41,64.52 68.33,69.6 68.33,71.63 v66.04,73.91
  Bottom 0.254: EXT.6 10.16,25.4 34.54,25.4 v35.05,25.91 36.07,26.92 65.02,26.92 R27.2 | v66.04,73.91 62.48,73.91 60.96,75.44 ISP.3
SCK_3V3
  Top 0.254: SD/MMC.5 88.14,50.04 89.92,48.26 89.92,37.85 88.9,36.83 R30.2 R27.1
SD_CE
  Top 0.254: MCU.20 71.12,25.4 71.12,40.64 R26.2
SD_CE_3V3
  Top 0.254: SD/MMC.1 78.23,50.04 80.77,47.5 80.77,43.69 R26.1 R29.2
SNES_CLK
  Top 0.254: JP5.2 71.63,5.59 68.33,5.59 68.33,2.54 SNES_P2.P$9 | MCU.37 25.4,40.64 16.26,40.64 16.26,10.41 JP4.2 15.75,6.86 15.75,4.57 13.72,2.54 SNES_P1.P$9
  Bottom 0.254: JP5.2 73.41,10.41 24.89,10.41 24.64,10.16 23.62,10.16 23.37,10.41 19.3,10.41 JP4.2
SNES_DATA1
  Top 0.254: MCU.40 21.59,36.83 21.59,10.16 JP4.4 22.86,3.81 SNES_P1.P$11
SNES_DATA2  (via drill 0.51)
  Top 0.254: MCU.39 26.67,34.29 v26.67,13.21 | SNES_P2.P$11 80.01,6.35 JP5.4
  Bottom 0.254: v26.67,13.21 75.69,13.21 JP5.4
SNES_LATCH
  Top 0.254: JP5.3 72.39,3.81 72.39,2.54 SNES_P2.P$10 | MCU.38 23.37,40.13 19.05,40.13 19.05,10.16 19.81,9.4 | 19.81,9.4 JP4.3 19.81,9.4 | 19.81,9.4 19.81,4.57 17.78,2.54 SNES_P1.P$10
  Bottom 0.254: JP5.3 75.95,7.37 21.84,7.37 JP4.3
UART_RX
  Bottom 0.254: 55.37,24.89 MCU.14 | 55.37,24.89 66.29,24.89 74.42,33.02 75.44,33.02 76.2,32.26 76.2,29.97 76.96,29.21 78.74,29.21 | 78.74,29.21 IC3.4 | 78.74,29.21 88.9,29.21 R4.1 | EXT.10 9.14,18.8 25.91,18.8 27.94,20.83 35.81,20.83 36.83,21.84 36.83,24.89 55.37,24.89
UART_TX  (via drill 0.51)
  Top 0.254: MCU.15 57.4,21.34 57.4,18.03 v54.61,15.24
  Bottom 0.254: v54.61,15.24 54.1,14.73 10.67,14.73 EXT.12
VIDEO_CE  (via drill 0.51)
  Top 0.254: v46.99,29.72 46.99,39.88 50.8,43.69 50.8,51.31 52.07,52.58 52.07,57.15 50.29,57.15 49.53,57.91 47.5,57.91 AD725.5 | v31.75,27.94 30.48,26.67 MCU.5
  Bottom 0.254: v46.99,29.72 45.21,27.94 v31.75,27.94
VIDEO_CLK  (via drill 0.51)
  Top 0.254: v49.28,54.86 49.28,55.37 47.5,55.37 AD725.3 | v35.18,53.34 34.8,52.32 34.8,48.01 | 34.8,47.24 34.8,48.01 | 34.8,47.24 34.8,48.01 | MCU.4 29.97,24.89 29.97,27.69 31.75,29.46 A/V.5 33.02,43.69 33.02,47.24 34.8,47.24
  Bottom 0.254: v49.28,54.86 47.5,53.34 v35.18,53.34
VIDEO_SYNC  (via drill 0.51)
  Top 0.254: v39.37,47.24 39.37,51.56 38.1,52.83 AD725.16 | MCU.1 20.57,23.11 v20.57,33.53
  Bottom 0.254: v20.57,33.53 24.13,37.08 24.13,40.64 26.67,40.64 | 26.67,40.64 27.43,40.64 | 26.67,40.64 27.43,40.64 | 27.43,40.64 A/V.3 30.99,40.64 34.29,40.64 39.37,45.72 v39.37,47.24

### Text on the board
tPlace: SD/MMC | 1 | 7-12VDC | 1 | 1 | MIDI IN | 1 | GND | MISO | PA4 | MOSI | PA5 | SCK | PA6 | RESET | PA7 | RX | PD3 | TX | PB1 | PD5 | VCC | PB2 | Uzebox V1.1 | http://uzebox.org | SNES P1 | SNES P2